# Altium schematic sheet HeaterDongle.SchDoc
size A
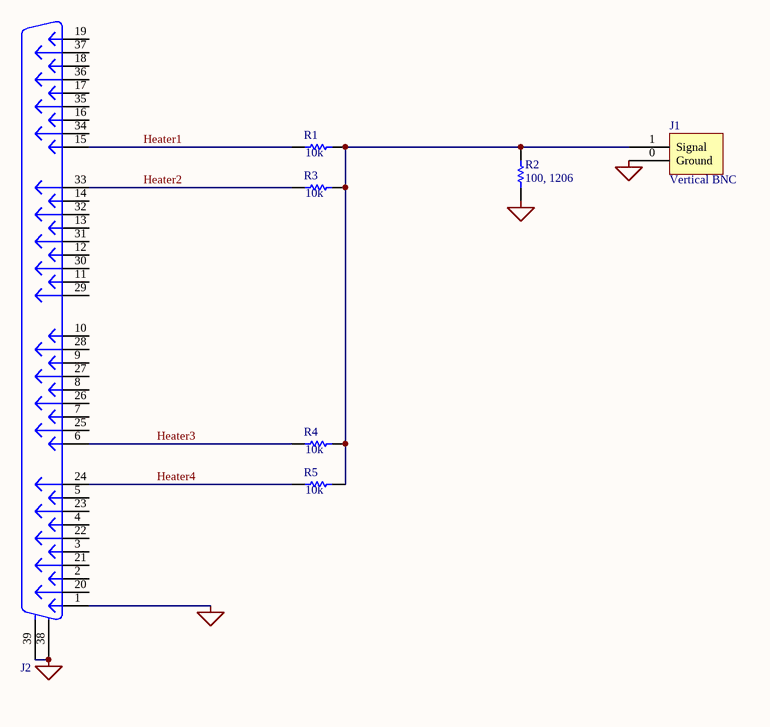
[diagram p0: HeaterDongle.SchDoc]

## Parts
J1  Vertical BNC  [BNCVert]
J2  DB37M  [DSUB37-M]  (value not drawn)
R1  value 10k  [0603]  (hidden comment: 10k 0603)
R2  100, 1206  [1206]
R3  value 10k  [0603]  (hidden comment: 10k 0603)
R4  value 10k  [0603]  (hidden comment: 10k 0603)
R5  value 10k  [0603]  (hidden comment: 10k 0603)

## Nets
GND: J1.0(Ground) J2.1 J2.38(MH1) J2.39(MH2) R2.1
Heater1: J2.15 R1.1
Heater2: J2.33 R3.1
Heater3: J2.6 R4.1
Heater4: J2.24 R5.1
NetJ1_1: J1.1(Signal) R1.2 R2.2 R3.2 R4.2 R5.2

Not connected (* = marked no-connect by the designer): J2 2 3 4 5 7 8 9 10 11 12 13 14 16 17 18 19 20 21 22 23 25 26 27 28 29 30 31 32 34 35 36 37

## Library data of the parts
J1 = BNCVertical
J2 = DB37M: Assembly Comments: none; Manufacturers Part Number: DB37M; Type: Connector; SupplierUnitCost: $3.35
R1 R3-R5 = RES 0603: Resistor; ManufacturerPartNumber: 10k 1/10W 1% 100ppm/C 0603; Manufacturer: Generic; ManufacturerPartNumber 1: e.g CRCW0603 series; Tolerance: 1%; Power: 1/10W; TempCoef: 100ppm/C; Supplier 1: Arrow; Supplier 2: Digi-Key; Supplier Part Number 1: 4070372S9500174N6892; Supplier Part Number 2: 541-0.0GDKR-ND
R2 = RES 1206: RES 100 OHM 1/4W 1206 SMD; Manufacturers Part Number: ESR18EZPF1000; Manufacturer: Rohm Semiconductor; Part constraints: 100 Ohm, 1206, 100ppm, 1%, 1/3W; Value: 100; Supplier 1: Digi-Key; Supplier Part Number 1: RHM100AFCT-ND